# EAGLE design riser-1u-can (EAGLE 6.2)
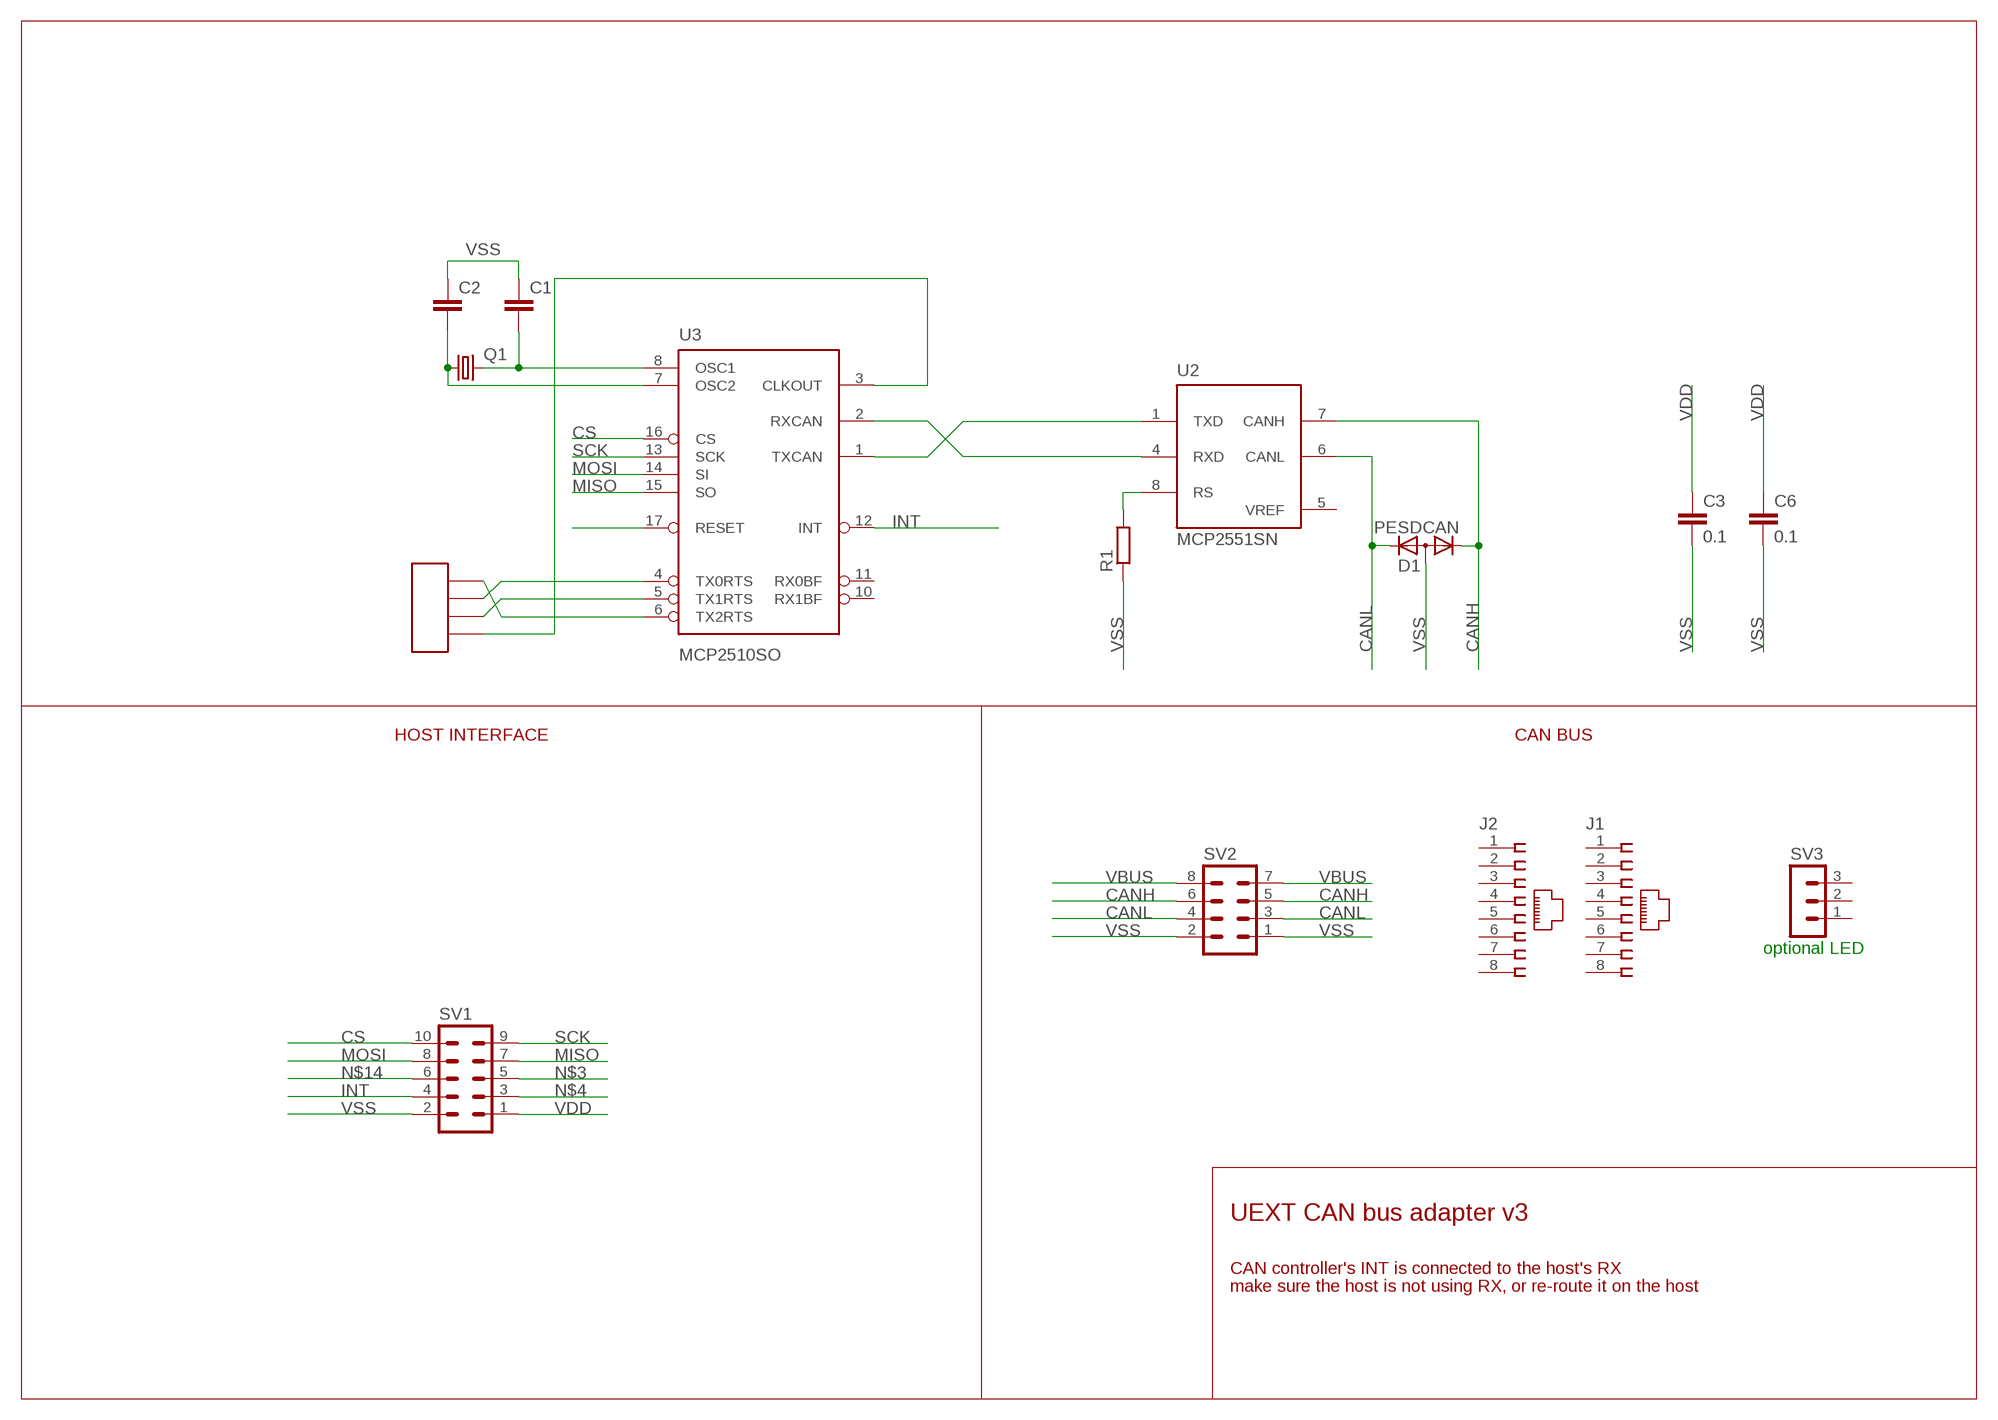
[diagram p0: schematic, sheet 1]

## Parts
C1  C-EUC0805  [C0805]
C2  C-EUC0805  [C0805]
C3  0.1  C-EUC0805  [C0805]
C6  0.1  C-EUC1206  [C1206]
D1  PESDCAN  DIODE-2CA|ACSOT23  [SOT23]
J1  215877-4  [215877-4]
J2  215877-4  [215877-4]
Q1  CRYSTALHC49S  [HC49/S]
R1  R-EU_R0603  [R0603]
SV1  MA05-2  [MA05-2]
SV2  MA04-2  [MA04-2]
SV3  MA03-1  [MA03-1]
U2  MCP2551SN  [SO-08]
U3  MCP2510SO  [SO-18W]
U$2  PIN_HEADER_2X2  [PIN_HEADER_2X2]

## Nets
CANH: D1.1(K1) SV2.5 SV2.6 U2.7(CANH)
CANL: D1.2(K2) SV2.3 SV2.4 U2.6(CANL)
CS: SV1.10 U3.16(CS)
INT: SV1.4 U3.12(INT)
MISO: SV1.7 U3.15(SO)
MOSI: SV1.8 U3.14(SI)
N$3: SV1.5
N$4: SV1.3
N$6: C1.2 Q1.2 U3.8(OSC1)
N$7: C2.2 Q1.1 U3.7(OSC2)
N$9: U3.3(CLKOUT) U$2.P$4
N$10: U3.5(TX1RTS) U$2.P$3
N$11: U3.4(TX0RTS) U$2.P$2
N$12: U3.6(TX2RTS) U$2.P$1
N$14: SV1.6
RESET_IN: U3.17(RESET)
RS: R1.2 U2.8(RS)
RXCAN: U2.4(RXD) U3.2(RXCAN)
SCK: SV1.9 U3.13(SCK)
TXCAN: U2.1(TXD) U3.1(TXCAN)
VBUS: SV2.7 SV2.8
VDD: C3.1 C6.1 SV1.1
VSS: C1.1 C2.1 C3.2 C6.2 D1.3(A) R1.1 SV1.2 SV2.1 SV2.2
Unconnected: J1.1 J1.2 J1.3 J1.4 J1.5 J1.6 J1.7 J1.8 J2.1 J2.2 J2.3 J2.4 J2.5 J2.6 J2.7 J2.8 SV3.1 SV3.2 SV3.3 U3.10(RX1BF) U3.11(RX0BF)

## Notes on the sheet
- HOST INTERFACE | CAN BUS
- optional LED
- UEXT CAN bus adapter v3
- CAN controller's INT is connected to the host's RX
- make sure the host is not using RX, or re-route it on the host

## Power pins joined to a net without a drawn wire
VDD: U2.3(VDD) U3.18(VDD)
VREF: U2.5(VREF)
VSS: U2.2(VSS) U3.9(VSS)

## Library data of the parts
C1-C3 C6 = rcl:C-EU: CAPACITOR, European symbol
D1 = diode:DIODE-2CA|AC: Dual DIODE Cathode-Anode|Anode-Cathode
J1 J2 = con-amp:215877-4: AMP connector
Q1 = crystal:CRYSTAL: CRYSTAL
R1 = rcl:R-EU_: RESISTOR, European symbol
SV1 = con-lstb:MA05-2: PIN HEADER; OC_FARNELL: unknown; OC_NEWARK: unknown
SV2 = con-lstb:MA04-2: PIN HEADER; OC_FARNELL: unknown; OC_NEWARK: unknown
SV3 = con-lstb:MA03-1: PIN HEADER; OC_FARNELL: unknown; OC_NEWARK: unknown
U2 = microchip_can:MCP2551: High Speed CAN tranceiver
U3 = my-microchip-can:MCP2510
U$2 = my:PIN_HEADER_2X2

## Board
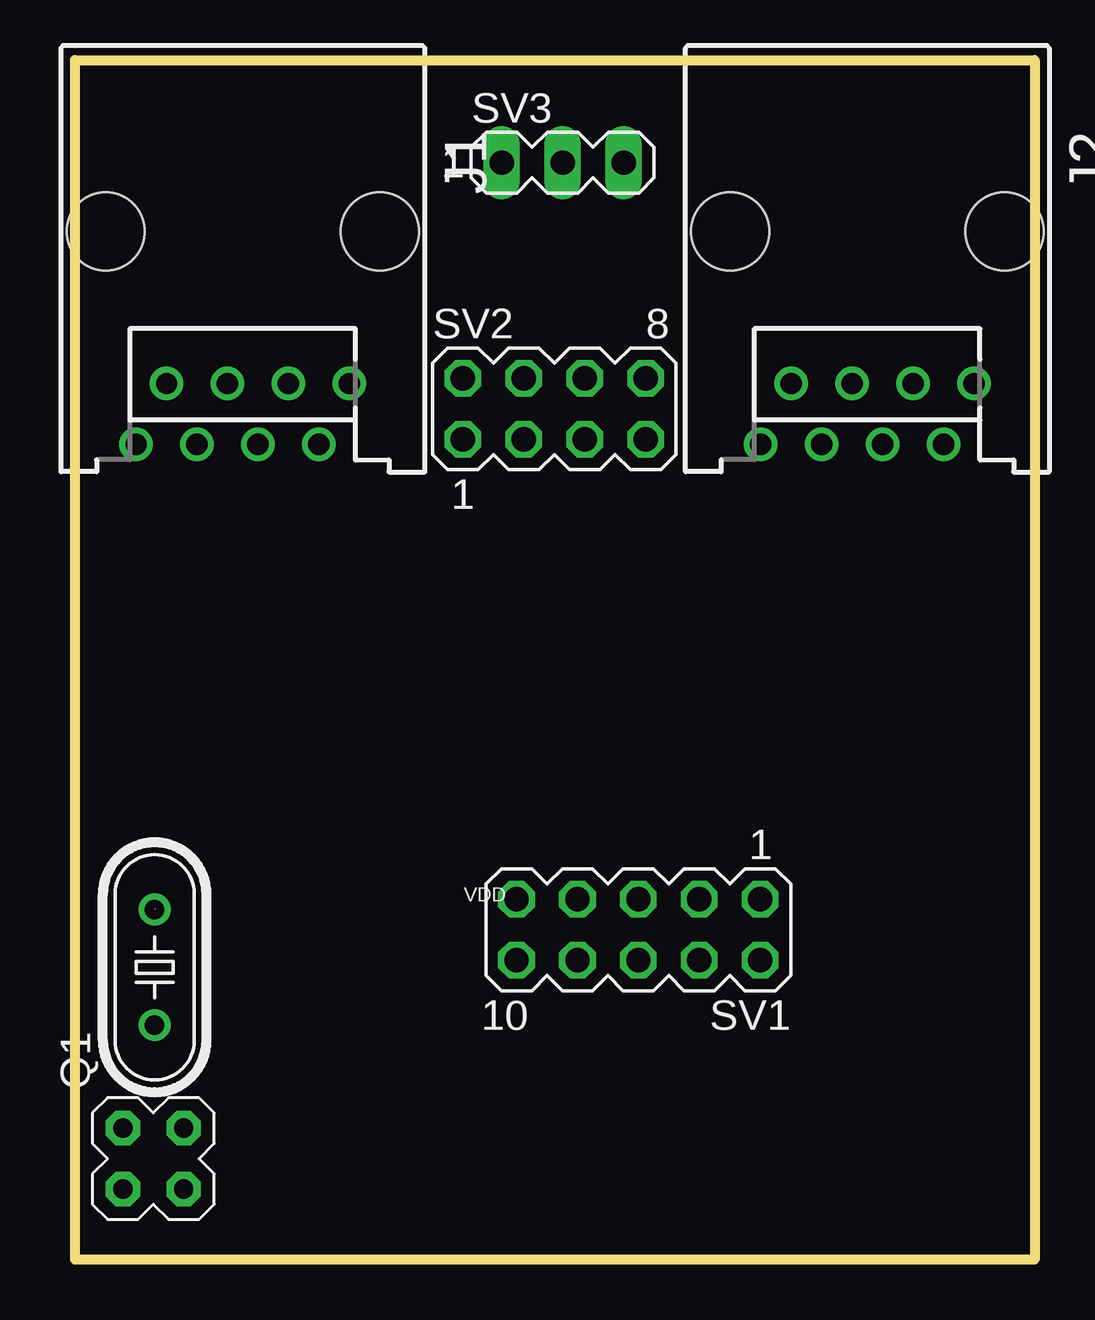
[diagram p1: board, top side]
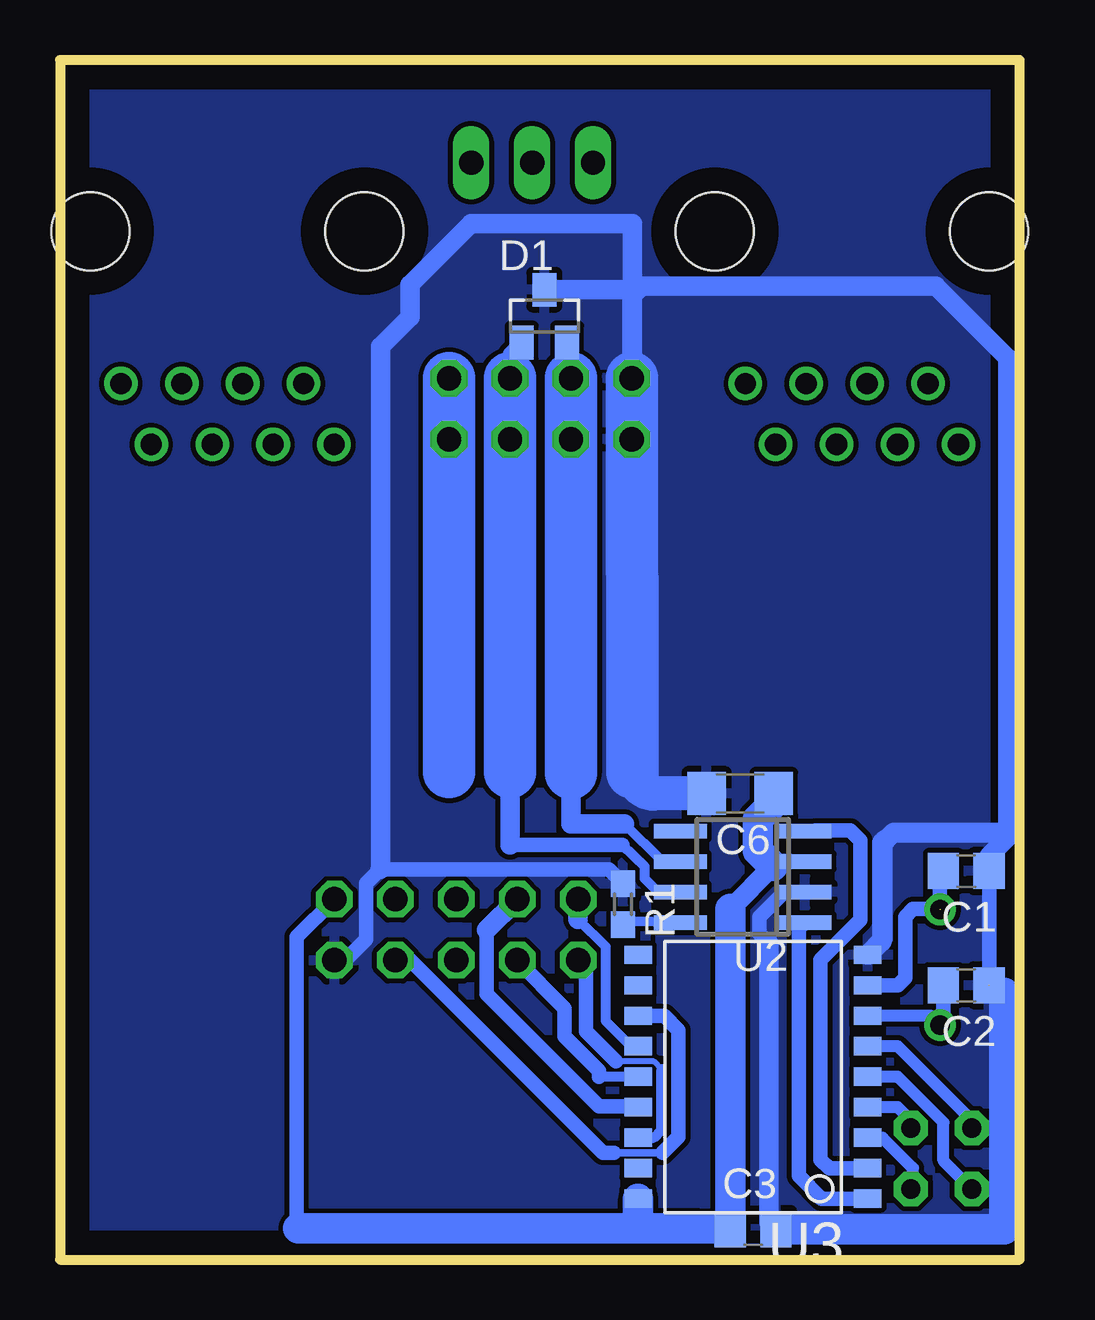
[diagram p2: board, bottom side, seen from below]

Size 40 x 50 mm. Coordinates in mm from the lower left corner, seen from the top.
Outline: 0,0 0,50 40,50 40,0 0,0
Copper layers (1*16): Top 0.035mm / dielectric 1.5mm / Bottom 0.035mm
Design rules: minimum track width 10mil, minimum drill 24mil, track to track 8mil, track to pad 8mil, pad to pad 8mil, via to via 8mil, smd to smd 8mil, copper to edge 40mil, drill to drill 8mil, minimum pad ring 10mil, minimum via ring 8mil, stop-mask expansion 4mil, vias tented up to drill 0mil, thermal gap 10mil

### Footprints (pad centres in the part's own frame; a part is rotated, then mirrored left to right if it is on the bottom)
C0805 = smd 1.3 x 1.5: 1 -0.95,0; 2 0.95,0
C1206 = smd 1.6 x 1.8: 1 -1.4,0; 2 1.4,0
SOT23 = smd 1 x 1.4: 1 -0.95,-1.1; 2 0.95,-1.1; 3 0,1.1
215877-4 = drill 0.889: 1 -4.445,6.35; 2 -3.175,8.89; 3 -1.905,6.35; 4 -0.635,8.89; 5 0.635,6.35; 6 1.905,8.89; 7 3.175,6.35; 8 4.445,8.89 | hole 3.251: -5.715,0; 5.715,0
HC49/S = drill 0.813: 1 -2.413,0; 2 2.413,0
R0603 = smd 1.1 x 1: 1 -0.85,0; 2 0.85,0
MA05-2 = drill 1.016 octagon: 1 -5.08,-1.27; 2 -5.08,1.27; 3 -2.54,-1.27; 4 -2.54,1.27; 5 0,-1.27; 6 0,1.27; 7 2.54,-1.27; 8 2.54,1.27; 9 5.08,-1.27; 10 5.08,1.27
MA04-2 = drill 1.016 octagon: 1 -3.81,-1.27; 2 -3.81,1.27; 3 -1.27,-1.27; 4 -1.27,1.27; 5 1.27,-1.27; 6 1.27,1.27; 7 3.81,-1.27; 8 3.81,1.27
MA03-1 = drill 1.016 long: 1 -2.54,0; 2 0,0; 3 2.54,0
SO-08 = smd 0.6 x 2.2: 1 -1.905,-2.6; 2 -0.635,-2.6; 3 0.635,-2.6; 4 1.905,-2.6; 5 1.905,2.6; 6 0.635,2.6; 7 -0.635,2.6; 8 -1.905,2.6
SO-18W = smd 0.762 x 1.143: 1 -5.08,-4.788; 2 -3.81,-4.788; 3 -2.54,-4.788; 4 -1.27,-4.788; 5 0,-4.788; 6 1.27,-4.788; 7 2.54,-4.788; 8 3.81,-4.788; 9 5.08,-4.788; 10 5.08,4.788; 11 3.81,4.788; 12 2.54,4.788; 13 1.27,4.788; 14 0,4.788; 15 -1.27,4.788; 16 -2.54,4.788; 17 -3.81,4.788; 18 -5.08,4.788
PIN_HEADER_2X2 = drill 0.8 pad 1.422 octagon: P$1 -1.27,-1.27; P$2 -1.27,1.27; P$3 1.27,-1.27; P$4 1.27,1.27

### Placement (x,y rotation side)
C1  2.22,16.19 180 bottom
C2  2.22,11.43 180 bottom
C3  11.11,1.27 0 bottom
C6  11.64,19.42 180 bottom
D1  19.8,39.32 0 bottom
J1  6.99,42.86 180 top
J2  33.02,42.86 180 top
Q1  3.31,12.18 90 top
R1  16.52,14.81 270 bottom
SV1  23.48,13.75 180 top
SV2  19.97,35.46 0 top
SV3  20.32,45.72 0 top
U2  11.54,15.95 90 bottom
U3  11.11,7.62 90 bottom
U$2  3.26,4.21 270 top

### Tracks (layer width: path | path; a pad name or v marks a point on that pad's centre or on a via)
CANH
  Bottom 0.406: U2.7 15.07,15.32 15.62,15.87 15.62,16.38 16.55,17.29
  Bottom 0.61: 16.55,17.29 21.24,17.29 | SV2.6 21.24,37.73 D1.1
  Bottom 0.813: 21.24,17.29 21.24,20.32
  Bottom 2.184: SV2.6 SV2.5 21.24,20.32
CANL
  Bottom 0.406: U2.6 14.89,16.59 16.46,18.15
  Bottom 0.61: 19.15,34.19 SV2.3 | D1.2 18.7,38.06 SV2.4
  Bottom 0.813: 18.7,20.29 18.7,18.15 16.46,18.15
  Bottom 1.016: SV2.3
  Bottom 2.184: SV2.4 SV2.3 18.7,20.29
CS
  Bottom 0.254: 14.92,7.94 15.24,8.26 16.83,8.26
  Bottom 0.406: U3.16 15.24,5.08 14.92,5.4 14.92,7.94 | 18.41,12.46 SV1.10
  Bottom 0.61: 18.41,12.46 18.08,12.12 18.08,9.52 16.83,8.27 16.83,8.26
INT
  Bottom 0.305: 14.89,4.44 16.9,4.44
  Bottom 0.61: U3.12 14.81,10.15 14.21,9.55 14.21,5.12 14.89,4.44 | 16.9,4.44 17.36,4.44 25.4,12.48 SV1.4
MISO
  Bottom 0.508: U3.15 15.94,6.39
  Bottom 0.61: 15.94,6.39 17.54,6.39 22.22,11.07 22.22,13.72 22.23,13.73
  Bottom 0.813: 22.23,13.73 SV1.7
MOSI
  Bottom 0.406: U3.14 17.54,7.62 | 20.95,12.46 SV1.8
  Bottom 0.61: 20.95,12.46 18.97,10.47 18.97,9.3 17.54,7.87 17.54,7.62
N$6  (1 unrouted)
  Bottom 0.61: U3.8 5.08,11.43 4.76,11.75 4.76,14.29 4.45,14.61 3.33,14.61 3.33,15.24 3.33,16.04 C1.2
N$7
  Bottom 0.508: U3.7 3.71,10.16 Q1.1
  Bottom 0.61: C2.2 3.17,9.91 Q1.1
N$9
  Bottom 0.508: U3.3 5.71,5.08 4.45,3.81 4.45,3.02 U$2.P$4
N$10
  Bottom 0.508: U3.5 5.08,7.62 3.17,5.71 3.17,4.12 U$2.P$3
N$11
  Bottom 0.508: U$2.P$2 4.53,5.8 5.08,6.35 U3.4
N$12
  Bottom 0.508: U3.6 5.08,8.89 1.91,5.71 1.91,5.56 U$2.P$1
RS
  Bottom 0.406: U2.8 16.41,14.09 R1.2
RXCAN
  Bottom 0.61: U3.2 7.94,3.81 8.29,4.17 8.29,12.5 6.63,14.16 6.63,17.47 7.05,17.89 8.51,17.89 U2.4
SCK
  Bottom 0.406: U3.13 16.19,8.89 17.26,9.96 17.26,13.05 18.4,14.19
  Bottom 0.813: SV1.9 18.4,14.19
TXCAN
  Bottom 0.61: U3.1 8.26,2.54 9.21,3.49 9.21,13.78 U2.1
VBUS
  Bottom 2.184: 23.78,20.32 SV2.7 SV2.8
VDD
  Bottom 0.61: 15.9,1.29 15.88,1.27 | U2.3 10.06,16.63 10.28,16.41 | C6.1 10.34,18.95 10.34,18.93 | SV1.1 30.13,13.45 30.13,1.23 30.07,1.29
  Bottom 0.813: 12.06,14.62 10.28,16.41
  Bottom 1.27: 15.9,1.29 U3.18 | 15.9,1.29 13.36,1.29 C3.1 12.06,14.62 | 10.34,18.93 10.91,18.36 10.91,17.04 10.28,16.41 | 30.07,1.29 15.9,1.29
VSS  (1 unrouted)
  Bottom 0.61: 0.64,11.11 0.79,11.27 | 0.79,11.27 0.95,11.43 | 1.59,16.19 1.27,15.88 C2.1 0.79,11.27 | C1.1 1.27,16.83 | R1.1 17.12,16.26 26.66,16.26 27.24,15.68 27.24,13.35 28.11,12.48 SV1.2 | U2.2 9.8,15.32 10.84,14.28 10.84,13.57 10.45,13.18
  Bottom 0.813: D1.3 16.16,40.42 SV2.2 | 16.14,20.3 16.14,40.17 | 16.14,40.17 16.14,43.18 22.86,43.18 25.4,40.64 25.4,39.29 26.64,38.05 26.64,16.28 26.66,16.26 | 16.14,40.17 15.73,40.58 3.5,40.58 0.49,37.57 0.49,17.89 0.59,17.79 5.28,17.79 5.69,17.38 5.69,13.36 6.35,12.7 6.28,12.7 5.73,13.25 5.73,17.39 5.64,17.48 5.55,17.48 5.23,17.8 0.59,17.8 0.53,17.86 0.53,17.57 1.27,16.83 | 10.45,13.18 10.45,1.56 C3.2
  Bottom 1.27: C3.2 0.64,1.27 0.64,11.11
  Bottom 1.422: C6.2 15.26,19.42 arc90 16.14,20.3
  Bottom 2.184: SV2.1 SV2.2 16.14,20.3
  pour Bottom: 0,0 40.01,0 40.01,49.85 0,49.85

### Text on the board
tPlace: VDD
tOrigins: SCK | MISO | SCL | TX | VDD | VDD | SSEL | MOSI | SDA | RX | VSS | VSS
tNames: On connector, RX and TX refer to host